# EAGLE schematic DETECT05 (EAGLE 6.1)
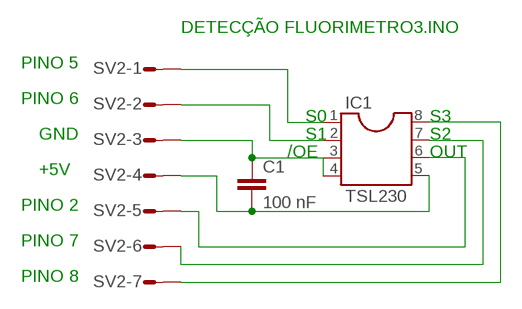
[diagram p0: schematic, sheet 1]

## Parts
C1  100 nF  C-EU050-030X075  [C050-030X075]
IC1  TSL230  DIL8  [DIL08]
SV2  L07P  [L07P]

## Nets
N$1: IC1.1 SV2.1
N$2: IC1.2 SV2.2
N$3: C1.1 IC1.3 IC1.4 SV2.3
N$5: C1.2 IC1.5 SV2.4
N$6: IC1.6 SV2.5
N$7: IC1.7 SV2.6
N$8: IC1.8 SV2.7

## Notes on the sheet
- DETECÇÃO FLUORIMETRO3.INO
- PINO 5
- PINO 6
- S0 | S3
- GND | S1 | S2
- /OE | OUT
- +5V
- PINO 2
- PINO 7
- PINO 8

## Library data of the parts
C1 = rcl:C-EU: CAPACITOR, European symbol
IC1 = ic-package:DIL8: Dual In Line / Socket
SV2 = con-amp-mt:L07P: AMP MT CONNECTOR; OC_FARNELL: unknown; OC_NEWARK: unknown